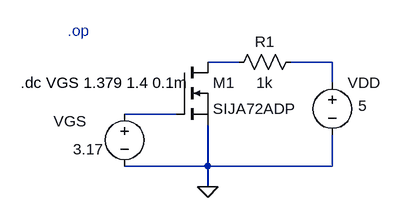
[diagram p0: schematic mosfetro.asc]
mosfetro.asc, the LTspice schematic file:
Version 4.1
SHEET 1 880 680
WIRE 272 80 224 80
WIRE 416 80 352 80
WIRE 416 112 416 80
WIRE 176 160 96 160
WIRE 224 240 224 176
WIRE 224 240 96 240
WIRE 416 240 416 192
WIRE 416 240 224 240
WIRE 224 272 224 240
FLAG 224 272 0
SYMBOL nmos 176 80 R0
SYMATTR InstName M1
SYMATTR Value SIJA72ADP
SYMBOL voltage 96 144 R0
WINDOW 0 -109 27 Left 2
WINDOW 3 -79 70 Left 2
WINDOW 123 0 0 Left 0
WINDOW 39 0 0 Left 0
SYMATTR InstName VGS
SYMATTR Value 3.17
SYMBOL voltage 416 96 R0
WINDOW 123 0 0 Left 0
WINDOW 39 0 0 Left 0
WINDOW 3 40 51 Left 2
SYMATTR Value 5
SYMATTR InstName VDD
SYMBOL res 368 64 R90
WINDOW 0 0 56 VBottom 2
WINDOW 3 32 56 VTop 2
SYMATTR InstName R1
SYMATTR Value 1k
TEXT -64 112 Left 2 !.dc VGS 1.379 1.4 0.1m
TEXT 8 32 Left 2 ;.op

The netlist it stands for:
* mosfetro.asc
M1 N001 N003 0 0 SIJA72ADP
VGS N003 0 3.17
VDD N002 0 5
R1 N002 N001 1k
.model NMOS NMOS
.model PMOS PMOS
.lib standard.mos
.dc VGS 1.379 1.4 0.1m
* .op
.backanno
.end